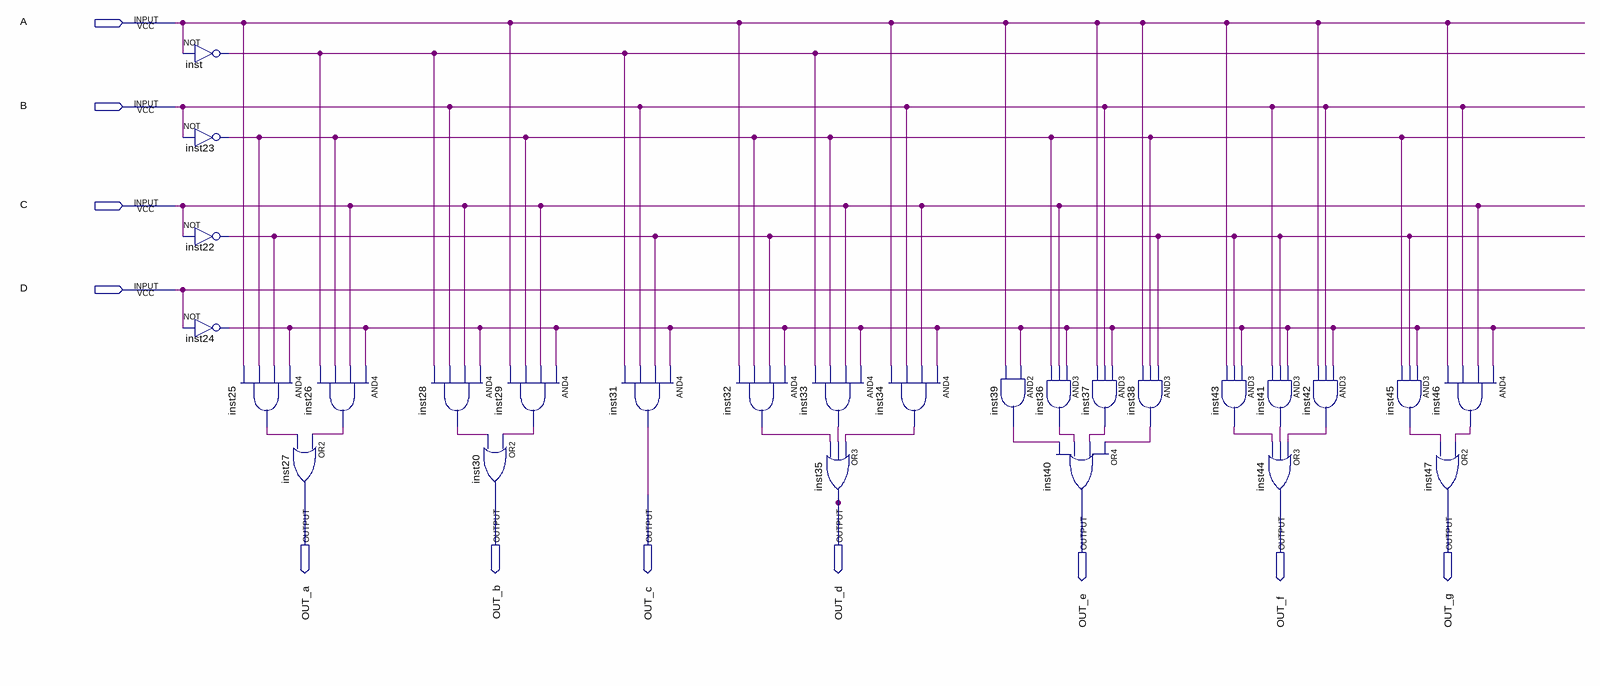
[diagram p0: schematic sheet]
// Quartus schematic formative.bdf as structural Verilog: 27 symbols, 11 pins
module formative (
  input  A,
  input  B,
  input  C,
  input  D,
  output OUT_a,
  output OUT_b,
  output OUT_c,
  output OUT_d,
  output OUT_e,
  output OUT_f,
  output OUT_g
);

  wire inst22_out, inst23_out, inst24_out, inst25_out, inst26_out, inst28_out, inst29_out, inst32_out,
       inst33_out, inst34_out, inst36_out, inst37_out, inst38_out, inst39_out, inst41_out, inst42_out,
       inst43_out, inst45_out, inst46_out, inst_out;

  not inst (inst_out, A);
  not inst23 (inst23_out, B);
  not inst22 (inst22_out, C);
  not inst24 (inst24_out, D);
  and inst25 (inst25_out, inst24_out, inst22_out, inst23_out, A);
  and inst26 (inst26_out, inst24_out, C, inst23_out, inst_out);
  or inst27 (OUT_a, inst26_out, inst25_out);
  and inst28 (inst28_out, inst24_out, C, B, inst_out);
  and inst29 (inst29_out, inst24_out, C, inst23_out, A);
  or inst30 (OUT_b, inst29_out, inst28_out);
  and inst31 (OUT_c, inst24_out, inst22_out, B, inst_out);
  and inst32 (inst32_out, inst24_out, inst22_out, inst23_out, A);
  and inst33 (inst33_out, inst24_out, C, inst23_out, inst_out);
  or inst35 (OUT_d, inst34_out, inst33_out, inst32_out);
  and inst34 (inst34_out, inst24_out, C, B, A);
  and inst39 (inst39_out, inst24_out, A);
  and inst36 (inst36_out, inst24_out, C, inst23_out);
  or inst40 (OUT_e, inst38_out, inst37_out, inst36_out, inst39_out);
  and inst37 (inst37_out, inst24_out, B, A);
  and inst38 (inst38_out, inst22_out, inst23_out, A);
  and inst43 (inst43_out, inst24_out, inst22_out, A);
  and inst41 (inst41_out, inst24_out, inst22_out, B);
  and inst42 (inst42_out, inst24_out, B, A);
  or inst44 (OUT_f, inst42_out, inst41_out, inst43_out);
  and inst45 (inst45_out, inst24_out, inst22_out, inst23_out);
  or inst47 (OUT_g, inst46_out, inst45_out);
  and inst46 (inst46_out, inst24_out, C, B, A);
endmodule
